# Altium schematic sheet Sheet.SchDoc
size A4; SheetNumber: 1; SheetTotal: 1
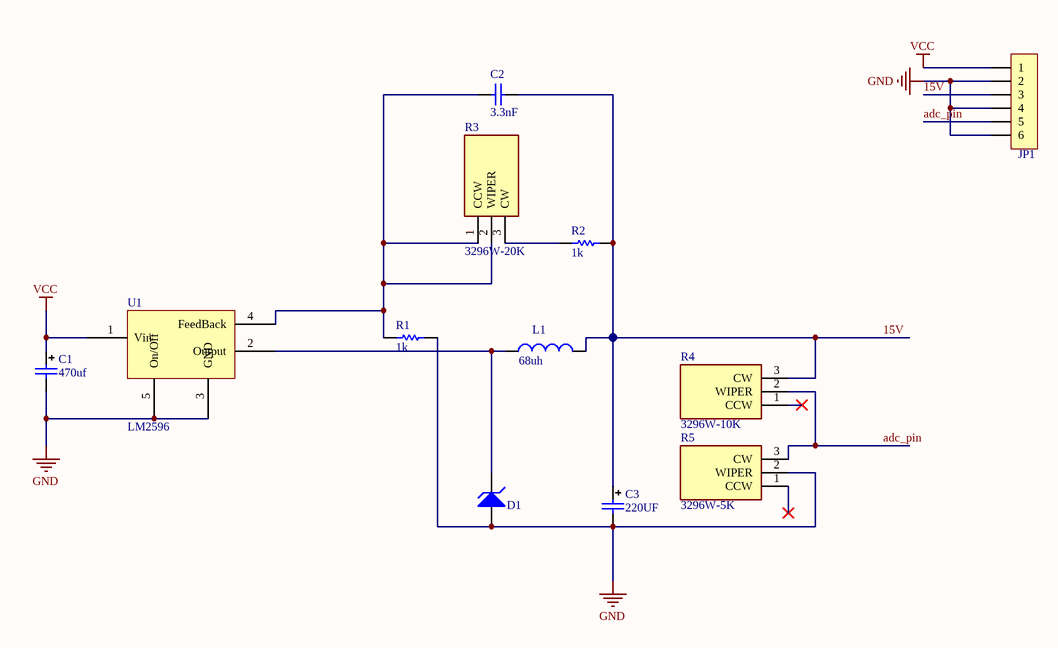
[diagram p0: Sheet.SchDoc]

## Parts
C1  470uf  [CAP 5.0*10*16]
C2  value 3.3nF  [C0805]  (hidden comment: CAP_0805)
C3  220UF  [CAP 5.0*10*16]
D1  Diode  Zener  [SMC]  (value not drawn)
JP1  HDR-1X6  [KF128-3.81-6P]  (value not drawn)
L1  68uh  [CDRH74]
R1  1k  [6-0805_M]
R2  1k  [6-0805_M]
R3  3296W-20K  [3296W-1]
R4  3296W-10K  [3296W-1]
R5  3296W-5K  [3296W-1]
U1  LM2596  [TO263-5A]

## Nets
GND: C1.2 C3.2 D1.1(A) JP1.2 JP1.4 JP1.6 R1.1 R5.2(WIPER) U1.3(GND) U1.5(On/Off)
VCC: C1.1 JP1.1 U1.1(Vin)
15V: C2.2 C3.1 JP1.3 L1.2 R2.2 R4.3(CW)
adc_pin: JP1.5 R4.2(WIPER) R5.3(CW)
NetC2_1: C2.1 R1.2 R3.1(CCW) R3.2(WIPER) U1.4(FeedBack)
NetD1_2: D1.2(K) L1.1 U1.2(Output)
NetR2_1: R2.1 R3.3(CW)

Not connected (* = marked no-connect by the designer): R4 1(CCW)*; R5 1(CCW)*

## Library data of the parts
C1 C3 = CAP_DIP
C2 = CAP_0805: Manufacturer: Generic Components; Class: Passive; SubClass: Capacitor; Published: 08/06/2000; Publisher: Altium Hobart Technology Centre
D1 = Diode  Zener: Zener Diode; Published: 8-Jun-2000; Revision: July-2002: Re-released for DXP Platform.; Publisher: Altium Limited
JP1 = Header 6: 6P接插件; 版权归属: 源创客; BOM名称: 6P接插件; 学习资源: www.ooocke.com
L1 = INDUCTOR: 电感; Code_IEC: 1005; Published: 8-Jun-2000; LatestRevisionDate: 17-Jul-2002; LatestRevisionNote: Re-released for DXP Platform.; PackageReference: 0402-A; Publisher: Altium Limited; Code_JEITA: 0402
R1 R2 = Res: 0805电阻; Manufacturer: Generic Components; Class: Passive; SubClass: Resistor; Published: 08/06/2000; Publisher: Altium Hobart Technology Centre
R3-R5 = 3296W-1-100LF: Resistor; Manufacturer_Name: Bourns; Datasheet Link: http://uk.rs-online.com/web/p/products/5219619; Manufacturer_Part_Number: 3296W-1-100LF; Mouser Part Number: 652-3296W-1-100LF; Mouser Price/Stock: https://www.mouser.co.uk/ProductDetail/Bourns/3296W-1-100LF?qs=QXsCy0sQn1AEVjRqsT9BNA%3D%3D; Arrow Part Number: 3296W-1-100LF; Arrow Price/Stock: https://www.arrow.com/en/products/3296w-1-100lf/bourns